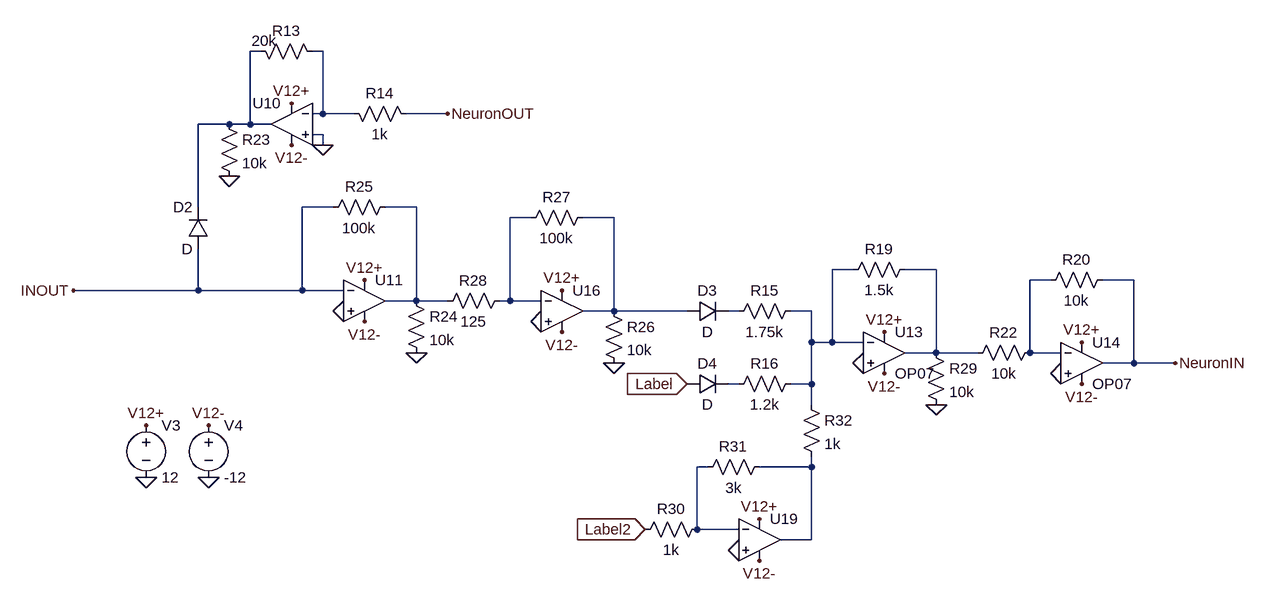
[diagram p0: schematic BiDirectionlAmp.asc]
BiDirectionlAmp.asc, the LTspice schematic file:
Version 4
SHEET 1 3500 692
WIRE 1280 -1504 1264 -1504
WIRE 1376 -1504 1360 -1504
WIRE 1376 -1408 1376 -1504
WIRE 1376 -1408 1360 -1408
WIRE 1424 -1408 1376 -1408
WIRE 1568 -1408 1504 -1408
WIRE 1232 -1392 1184 -1392
WIRE 1264 -1392 1264 -1504
WIRE 1264 -1392 1232 -1392
WIRE 1296 -1392 1264 -1392
WIRE 1376 -1376 1360 -1376
WIRE 1376 -1360 1376 -1376
WIRE 1184 -1264 1184 -1392
WIRE 1392 -1264 1344 -1264
WIRE 1520 -1264 1472 -1264
WIRE 1696 -1248 1664 -1248
WIRE 1824 -1248 1776 -1248
WIRE 2192 -1168 2160 -1168
WIRE 2320 -1168 2272 -1168
WIRE 2496 -1152 2464 -1152
WIRE 2624 -1152 2576 -1152
WIRE 1184 -1136 1184 -1200
WIRE 1184 -1136 992 -1136
WIRE 1344 -1136 1344 -1264
WIRE 1344 -1136 1184 -1136
WIRE 1408 -1136 1344 -1136
WIRE 1520 -1120 1520 -1264
WIRE 1520 -1120 1472 -1120
WIRE 1568 -1120 1520 -1120
WIRE 1664 -1120 1664 -1248
WIRE 1664 -1120 1648 -1120
WIRE 1712 -1120 1664 -1120
WIRE 1824 -1104 1824 -1248
WIRE 1824 -1104 1776 -1104
WIRE 1936 -1104 1824 -1104
WIRE 2016 -1104 2000 -1104
WIRE 2128 -1104 2096 -1104
WIRE 2128 -1056 2128 -1104
WIRE 2160 -1056 2160 -1168
WIRE 2160 -1056 2128 -1056
WIRE 2208 -1056 2160 -1056
WIRE 2320 -1040 2320 -1168
WIRE 2320 -1040 2272 -1040
WIRE 2384 -1040 2320 -1040
WIRE 2464 -1040 2464 -1152
WIRE 2512 -1040 2464 -1040
WIRE 2624 -1024 2624 -1152
WIRE 2624 -1024 2576 -1024
WIRE 2688 -1024 2624 -1024
WIRE 2016 -992 2000 -992
WIRE 2128 -992 2128 -1056
WIRE 2128 -992 2096 -992
WIRE 2128 -960 2128 -992
WIRE 1968 -864 1952 -864
WIRE 2128 -864 2128 -880
WIRE 2128 -864 2048 -864
WIRE 1952 -768 1952 -864
WIRE 2016 -768 1952 -768
WIRE 2128 -752 2128 -864
WIRE 2128 -752 2080 -752
FLAG 992 -1136 INOUT
FLAG 2688 -1024 NeuronIN
FLAG 1568 -1408 NeuronOUT
FLAG 1104 -848 0
FLAG 1200 -848 0
FLAG 1104 -928 V12+
FLAG 1200 -928 V12-
FLAG 1328 -1360 V12-
FLAG 1328 -1424 V12+
FLAG 1376 -1360 0
FLAG 1440 -1088 V12-
FLAG 1440 -1152 V12+
FLAG 2208 -1024 0
FLAG 2512 -1008 0
FLAG 2240 -1072 V12+
FLAG 2544 -1056 V12+
FLAG 2240 -1008 V12-
FLAG 2544 -992 V12-
FLAG 1232 -1312 0
FLAG 1408 -1104 0
FLAG 1520 -1040 0
FLAG 1712 -1088 0
FLAG 1824 -1024 0
FLAG 2320 -960 0
FLAG 1744 -1136 V12+
FLAG 1744 -1072 V12-
FLAG 2048 -720 V12-
FLAG 2048 -784 V12+
FLAG 2016 -736 0
FLAG 1936 -992 Label
IOPIN 1936 -992 In
FLAG 1872 -768 Label2
IOPIN 1872 -768 In
SYMBOL voltage 1104 -944 R0
WINDOW 123 0 0 Left 2
WINDOW 39 0 0 Left 2
SYMATTR InstName V3
SYMATTR Value 12
SYMBOL voltage 1200 -944 R0
WINDOW 123 0 0 Left 2
WINDOW 39 0 0 Left 2
SYMATTR InstName V4
SYMATTR Value -12
SYMBOL Opamps\\UniversalOpamp2 1328 -1392 M0
SYMATTR InstName U10
SYMBOL res 1264 -1520 M90
WINDOW 0 0 56 VBottom 2
WINDOW 3 -16 22 VTop 2
SYMATTR InstName R13
SYMATTR Value 20k
SYMBOL res 1408 -1424 M90
WINDOW 0 0 56 VBottom 2
WINDOW 3 32 56 VTop 2
SYMATTR InstName R14
SYMATTR Value 1k
SYMBOL Opamps\\UniversalOpamp2 1440 -1120 R0
SYMATTR InstName U11
SYMBOL diode 1200 -1200 R180
WINDOW 0 24 64 Left 2
WINDOW 3 24 0 Left 2
SYMATTR InstName D2
SYMBOL diode 1936 -1088 R270
WINDOW 0 32 32 VTop 2
WINDOW 3 0 32 VBottom 2
SYMATTR InstName D3
SYMBOL Opamps\\OP07 2240 -1104 R0
SYMATTR InstName U13
SYMBOL res 2112 -1120 R90
WINDOW 0 0 56 VBottom 2
WINDOW 3 32 56 VTop 2
SYMATTR InstName R15
SYMATTR Value 1.75k
SYMBOL res 2112 -1008 R90
WINDOW 0 0 56 VBottom 2
WINDOW 3 32 56 VTop 2
SYMATTR InstName R16
SYMATTR Value 1.2k
SYMBOL res 2288 -1184 R90
WINDOW 0 0 56 VBottom 2
WINDOW 3 32 56 VTop 2
SYMATTR InstName R19
SYMATTR Value 1.5k
SYMBOL Opamps\\OP07 2544 -1088 R0
SYMATTR InstName U14
SYMBOL res 2592 -1168 R90
WINDOW 0 0 56 VBottom 2
WINDOW 3 32 56 VTop 2
SYMATTR InstName R20
SYMATTR Value 10k
SYMBOL res 2480 -1056 R90
WINDOW 0 0 56 VBottom 2
WINDOW 3 32 56 VTop 2
SYMATTR InstName R22
SYMATTR Value 10k
SYMBOL diode 1936 -976 R270
WINDOW 0 32 32 VTop 2
WINDOW 3 0 32 VBottom 2
SYMATTR InstName D4
SYMBOL res 1216 -1408 R0
SYMATTR InstName R23
SYMATTR Value 10k
SYMBOL res 1504 -1136 R0
SYMATTR InstName R24
SYMATTR Value 10k
SYMBOL res 1488 -1280 R90
WINDOW 0 0 56 VBottom 2
WINDOW 3 32 56 VTop 2
SYMATTR InstName R25
SYMATTR Value 100k
SYMBOL Opamps\\UniversalOpamp2 1744 -1104 R0
SYMATTR InstName U16
SYMBOL res 1808 -1120 R0
SYMATTR InstName R26
SYMATTR Value 10k
SYMBOL res 1792 -1264 R90
WINDOW 0 0 56 VBottom 2
WINDOW 3 32 56 VTop 2
SYMATTR InstName R27
SYMATTR Value 100k
SYMBOL res 1664 -1136 R90
WINDOW 0 0 56 VBottom 2
WINDOW 3 32 56 VTop 2
SYMATTR InstName R28
SYMATTR Value 125
SYMBOL res 2304 -1056 R0
SYMATTR InstName R29
SYMATTR Value 10k
SYMBOL Opamps\\UniversalOpamp2 2048 -752 R0
SYMATTR InstName U19
SYMBOL res 1968 -784 R90
WINDOW 0 0 56 VBottom 2
WINDOW 3 32 56 VTop 2
SYMATTR InstName R30
SYMATTR Value 1k
SYMBOL res 2064 -880 R90
WINDOW 0 0 56 VBottom 2
WINDOW 3 32 56 VTop 2
SYMATTR InstName R31
SYMATTR Value 3k
SYMBOL res 2112 -976 R0
SYMATTR InstName R32
SYMATTR Value 1k

The netlist it stands for:
* BiDirectionlAmp.asc
V3 V12+ 0 12
V4 V12- 0 -12
XU10 0 N002 V12+ V12- N001 level.2 Avol=1Meg GBW=10Meg Slew=10Meg ilimit=25m rail=0 Vos=0 phimargin=45 en=0 enk=0 in=0 ink=0 Rin=500Meg  ; pins IN+ IN- V+ V- OUT
R13 N001 N002 20k
R14 N002 NeuronOUT 1k
XU11 0 INOUT V12+ V12- N003 level.2 Avol=1Meg GBW=10Meg Slew=10Meg ilimit=25m rail=0 Vos=0 phimargin=45 en=0 enk=0 in=0 ink=0 Rin=500Meg  ; pins IN+ IN- V+ V- OUT
D2 INOUT N001 D
D3 N005 N009 D
XU13 0 N006 V12+ V12- N007 LT1001  ; OP07, pins In+ In- V+ V- OUT
R15 N006 N009 1.75k
R16 N006 N010 1.2k
R19 N007 N006 1.5k
XU14 0 N008 V12+ V12- NeuronIN LT1001  ; OP07, pins In+ In- V+ V- OUT
R20 NeuronIN N008 10k
R22 N008 N007 10k
D4 Label N010 D
R23 N001 0 10k
R24 N003 0 10k
R25 N003 INOUT 100k
XU16 0 N004 V12+ V12- N005 level.2 Avol=1Meg GBW=10Meg Slew=10Meg ilimit=25m rail=0 Vos=0 phimargin=45 en=0 enk=0 in=0 ink=0 Rin=500Meg  ; pins IN+ IN- V+ V- OUT
R26 N005 0 10k
R27 N005 N004 100k
R28 N004 N003 125
R29 N007 0 10k
XU19 0 N011 V12+ V12- N012 level.2 Avol=1Meg GBW=10Meg Slew=10Meg ilimit=25m rail=0 Vos=0 phimargin=45 en=0 enk=0 in=0 ink=0 Rin=500Meg  ; pins IN+ IN- V+ V- OUT
R30 N011 Label2 1k
R31 N012 N011 3k
R32 N006 N012 1k
.model D D
.lib standard.dio
.lib UniversalOpamps2.sub
.lib LTC.lib
.backanno
.end